# Altium project IntelliModule-Alpha.PrjPcb (part 2 of 2)

## Sheet [03] - mPCIe Connector.SchDoc: mPCIe Connector
size A3; Date: N.A.; ApprovedBy: N.A.; CheckedBy: N.A.; Author: N.A.; CompanyName: Johannes Berndorfer; DrawnBy: JBE; Organization: N.A.; Address1: Konrad Grefe Gasse 22; Address2: 1230 Wien; Address3: AUSTRIA; Address4: N.A.; DocumentNumber: 3; Revision: A; SheetNumber: 3; SheetTotal: 3; ProjectTitle: IntelliModule-Alpha; Reviewer: -; Time: N.A.; ImagePath: N.A.; Application_BuildNumber: N.A.
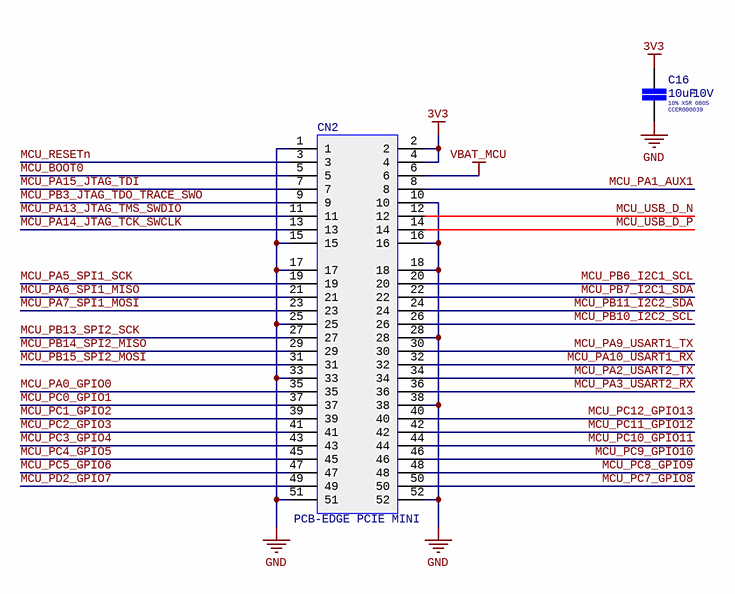
[diagram p2: [03] - mPCIe Connector.SchDoc]

### Parts
C16  Internal Part Number: CCER000039  Tolerance: 10%  Voltage Rating: 10V  Dielectric: X5R  Case/Package: 0805  Capacitance: 10uF  [CAP-SMD-0805-1.35MM-IPC-MED]  (hidden comment: 10uF 10V)
CN2  PCB-EDGE PCIE MINI  [CON-PCB-EDGE-PCIE-MINI-CARD-52POS]

### Nets
3V3: C16.1 CN2.2 CN2.4
GND: C16.2 CN2.1 CN2.10 CN2.15 CN2.16 CN2.17 CN2.18 CN2.25 CN2.28 CN2.33 CN2.38 CN2.51 CN2.52
VBAT_MCU: CN2.6
MCU_BOOT0: CN2.5
MCU_PA0_GPIO0: CN2.35
MCU_PA1_AUX1: CN2.8
MCU_PA2_USART2_TX: CN2.34
MCU_PA3_USART2_RX: CN2.36
MCU_PA5_SPI1_SCK: CN2.19
MCU_PA6_SPI1_MISO: CN2.21
MCU_PA7_SPI1_MOSI: CN2.23
MCU_PA9_USART1_TX: CN2.30
MCU_PA10_USART1_RX: CN2.32
MCU_PA13_JTAG_TMS_SWDIO: CN2.11
MCU_PA14_JTAG_TCK_SWCLK: CN2.13
MCU_PA15_JTAG_TDI: CN2.7
MCU_PB3_JTAG_TDO_TRACE_SWO: CN2.9
MCU_PB6_I2C1_SCL: CN2.20
MCU_PB7_I2C1_SDA: CN2.22
MCU_PB10_I2C2_SCL: CN2.26
MCU_PB11_I2C2_SDA: CN2.24
MCU_PB13_SPI2_SCK: CN2.27
MCU_PB14_SPI2_MISO: CN2.29
MCU_PB15_SPI2_MOSI: CN2.31
MCU_PC0_GPIO1: CN2.37
MCU_PC1_GPIO2: CN2.39
MCU_PC2_GPIO3: CN2.41
MCU_PC3_GPIO4: CN2.43
MCU_PC4_GPIO5: CN2.45
MCU_PC5_GPIO6: CN2.47
MCU_PC7_GPIO8: CN2.50
MCU_PC8_GPIO9: CN2.48
MCU_PC9_GPIO10: CN2.46
MCU_PC10_GPIO11: CN2.44
MCU_PC11_GPIO12: CN2.42
MCU_PC12_GPIO13: CN2.40
MCU_PD2_GPIO7: CN2.49
MCU_RESETn: CN2.3
MCU_USB_D_N: CN2.12
MCU_USB_D_P: CN2.14

### Notes on the sheet
- Title:
- Project:
- Document Nr.:
- Revision:
- Date:
- Drawn By:
- Time:
- Reviewed By:
- Sheet
- of
- Size:
- A3
- Variant:
- File:

### Library data of the parts
C16 = CL21A106KPFNNNG: CAP CER 10U 10V X5R 10% SMD 0805 85C SAMSUNG; Supplier 1: Digi-Key; Manufacturer 1: Samsung; Manufacturer Part Number 1: CL21A106KPFNNNG; Stock 1: 884042; Pricing 1: 1=0,14000, 10=0,10000, 100=0,04690, 500=0,03290, 1000=0,02724 (USD); RoHS: Yes; Mount: Surface Mount; Case Code (Metric): 2012; Case Code (Imperial): 0805; Min Operating Temperature: -55°C; Max Operating Temperature: 85°C; Voltage: 10V; Packaging: Tape and Reel; Package Quantity: 3000; Termination: Wraparound; Length: 2mm; Height: 1.25mm; Depth: 1.25mm; Width: 0.049inch; Thickness: 0.053inch; Radiation Hardening: No; Lead Free: Lead Free; ComponentLink1URL: https://datasheet.ciiva.com/16428/cl21a106kpfnnng-16428896.pdf?src-supplier=Future+Electronics; ComponentLink1Description: https://datasheet.ciiva.com/16428/cl21a106kpfnnng-16428896.pdf?src-supplier=Future+Electronics; ComponentLink2URL: https://datasheet.ciiva.com/26936/getdatasheetpartid-640497-26936900.pdf?src-supplier=Verical; ComponentLink2Description: https://datasheet.ciiva.com/26936/getdatasheetpartid-640497-26936900.pdf?src-supplier=Verical; Supplier Part Number 1: 1276-6456-1-ND
CN2 = PCB-EDGE PCIE MINI: PCIE MINI CARD PCB EDGE

## Nets that join several sheets
3V3: [02] - Microcontroller (29 pins), [03] - mPCIe Connector (C16.1 CN2.2 CN2.4)
GND: [02] - Microcontroller (42 pins), [03] - mPCIe Connector (13 pins)
VBAT_MCU: [02] - Microcontroller (C8.1 C9.1 U2.1), [03] - mPCIe Connector (CN2.6)
MCU_BOOT0: [02] - Microcontroller (R14.2 U2.60), [03] - mPCIe Connector (CN2.5)
MCU_PA0_GPIO0: [02] - Microcontroller (U2.14), [03] - mPCIe Connector (CN2.35)
MCU_PA1_AUX1: [02] - Microcontroller (U2.15), [03] - mPCIe Connector (CN2.8)
MCU_PA2_USART2_TX: [02] - Microcontroller (U2.16), [03] - mPCIe Connector (CN2.34)
MCU_PA3_USART2_RX: [02] - Microcontroller (U2.17), [03] - mPCIe Connector (CN2.36)
MCU_PA5_SPI1_SCK: [02] - Microcontroller (U2.21), [03] - mPCIe Connector (CN2.19)
MCU_PA6_SPI1_MISO: [02] - Microcontroller (U2.22), [03] - mPCIe Connector (CN2.21)
MCU_PA7_SPI1_MOSI: [02] - Microcontroller (U2.23), [03] - mPCIe Connector (CN2.23)
MCU_PA9_USART1_TX: [02] - Microcontroller (CN1.8 U2.42), [03] - mPCIe Connector (CN2.30)
MCU_PA10_USART1_RX: [02] - Microcontroller (CN1.9 U2.43), [03] - mPCIe Connector (CN2.32)
MCU_PA13_JTAG_TMS_SWDIO: [02] - Microcontroller (CN1.5 U2.46), [03] - mPCIe Connector (CN2.11)
MCU_PA14_JTAG_TCK_SWCLK: [02] - Microcontroller (CN1.3 U2.49), [03] - mPCIe Connector (CN2.13)
MCU_PA15_JTAG_TDI: [02] - Microcontroller (CN1.6 U2.50), [03] - mPCIe Connector (CN2.7)
MCU_PB3_JTAG_TDO_TRACE_SWO: [02] - Microcontroller (CN1.7 U2.55), [03] - mPCIe Connector (CN2.9)
MCU_PB6_I2C1_SCL: [02] - Microcontroller (R1.2 U1.6 U2.58), [03] - mPCIe Connector (CN2.20)
MCU_PB7_I2C1_SDA: [02] - Microcontroller (R2.2 U1.5 U2.59), [03] - mPCIe Connector (CN2.22)
MCU_PB10_I2C2_SCL: [02] - Microcontroller (R24.2 U2.29), [03] - mPCIe Connector (CN2.26)
MCU_PB11_I2C2_SDA: [02] - Microcontroller (R23.2 U2.30), [03] - mPCIe Connector (CN2.24)
MCU_PB13_SPI2_SCK: [02] - Microcontroller (U2.34), [03] - mPCIe Connector (CN2.27)
MCU_PB14_SPI2_MISO: [02] - Microcontroller (U2.35), [03] - mPCIe Connector (CN2.29)
MCU_PB15_SPI2_MOSI: [02] - Microcontroller (U2.36), [03] - mPCIe Connector (CN2.31)
MCU_PC0_GPIO1: [02] - Microcontroller (U2.8), [03] - mPCIe Connector (CN2.37)
MCU_PC1_GPIO2: [02] - Microcontroller (U2.9), [03] - mPCIe Connector (CN2.39)
MCU_PC2_GPIO3: [02] - Microcontroller (U2.10), [03] - mPCIe Connector (CN2.41)
MCU_PC3_GPIO4: [02] - Microcontroller (U2.11), [03] - mPCIe Connector (CN2.43)
MCU_PC4_GPIO5: [02] - Microcontroller (U2.24), [03] - mPCIe Connector (CN2.45)
MCU_PC5_GPIO6: [02] - Microcontroller (U2.25), [03] - mPCIe Connector (CN2.47)
MCU_PC7_GPIO8: [02] - Microcontroller (U2.38), [03] - mPCIe Connector (CN2.50)
MCU_PC8_GPIO9: [02] - Microcontroller (U2.39), [03] - mPCIe Connector (CN2.48)
MCU_PC9_GPIO10: [02] - Microcontroller (U2.40), [03] - mPCIe Connector (CN2.46)
MCU_PC10_GPIO11: [02] - Microcontroller (U2.51), [03] - mPCIe Connector (CN2.44)
MCU_PC11_GPIO12: [02] - Microcontroller (U2.52), [03] - mPCIe Connector (CN2.42)
MCU_PC12_GPIO13: [02] - Microcontroller (U2.53), [03] - mPCIe Connector (CN2.40)
MCU_PD2_GPIO7: [02] - Microcontroller (U2.54), [03] - mPCIe Connector (CN2.49)
MCU_RESETn: [02] - Microcontroller (CN1.1 R15.2 U2.7), [03] - mPCIe Connector (CN2.3)
MCU_USB_D_N: [02] - Microcontroller (U2.44), [03] - mPCIe Connector (CN2.12)
MCU_USB_D_P: [02] - Microcontroller (R20.2 U2.45), [03] - mPCIe Connector (CN2.14)